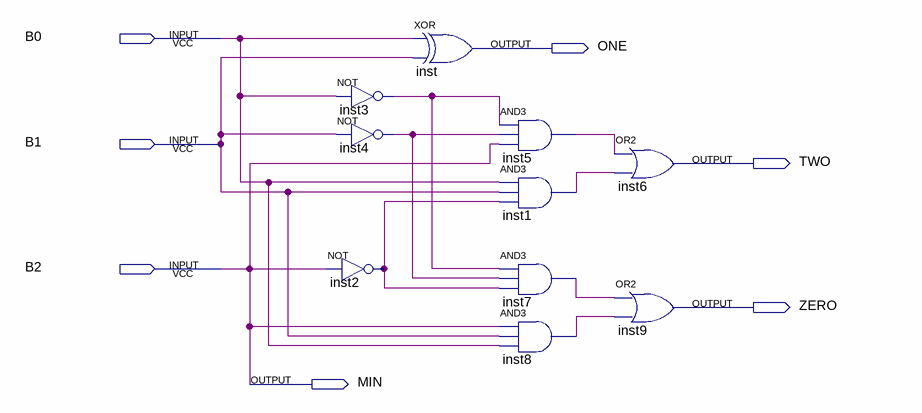
[diagram p0: schematic sheet]
// Quartus schematic BoothEncoder.bdf as structural Verilog: 10 symbols, 7 pins
module BoothEncoder (
  input  B0,
  input  B1,
  input  B2,
  output ONE,
  output TWO,
  output ZERO,
  output MIN
);

  wire inst1_out, inst2_out, inst3_out, inst4_out, inst5_out, inst7_out, inst8_out;

  not inst3 (inst3_out, B0);
  not inst4 (inst4_out, B1);
  not inst2 (inst2_out, B2);
  xor inst (ONE, B0, B1);
  and inst5 (inst5_out, inst3_out, inst4_out, B2);
  and inst1 (inst1_out, B0, B1, inst2_out);
  and inst7 (inst7_out, inst3_out, inst4_out, inst2_out);
  and inst8 (inst8_out, B2, B1, B0);
  or inst6 (TWO, inst5_out, inst1_out);
  or inst9 (ZERO, inst7_out, inst8_out);

  assign MIN = B2;
endmodule
